# Altium project MCU_PS.PrjPcb
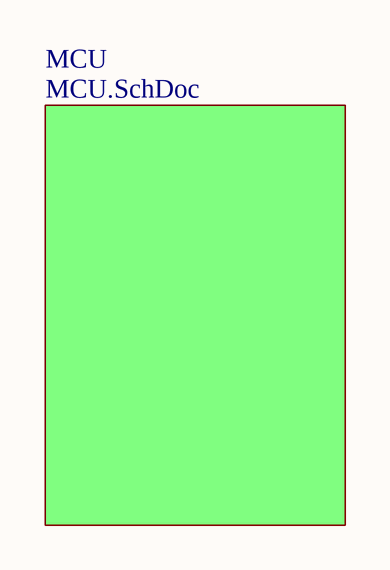
[diagram p0: Main.SchDoc]
2 sheets, 1 parts. Net scope: global (net labels, ports and power ports of the same name join across sheets).
Board file: MCU_PS.PcbDoc
Sheets:
  Main.SchDoc
    MCU = MCU.SchDoc

## Sheet Main.SchDoc
size A4

### Sub-sheets
MCU = MCU.SchDoc: no entries

## Sheet MCU.SchDoc
size A4
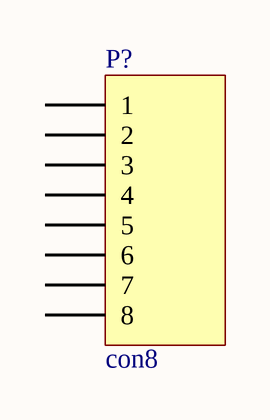
[diagram p1: MCU.SchDoc]

### Parts
P?  con8  [691305140008]

### Nets

Not connected (* = marked no-connect by the designer): P? 1 2 3 4 5 6 7 8

### Library data of the parts
P? = con8: System: Connector